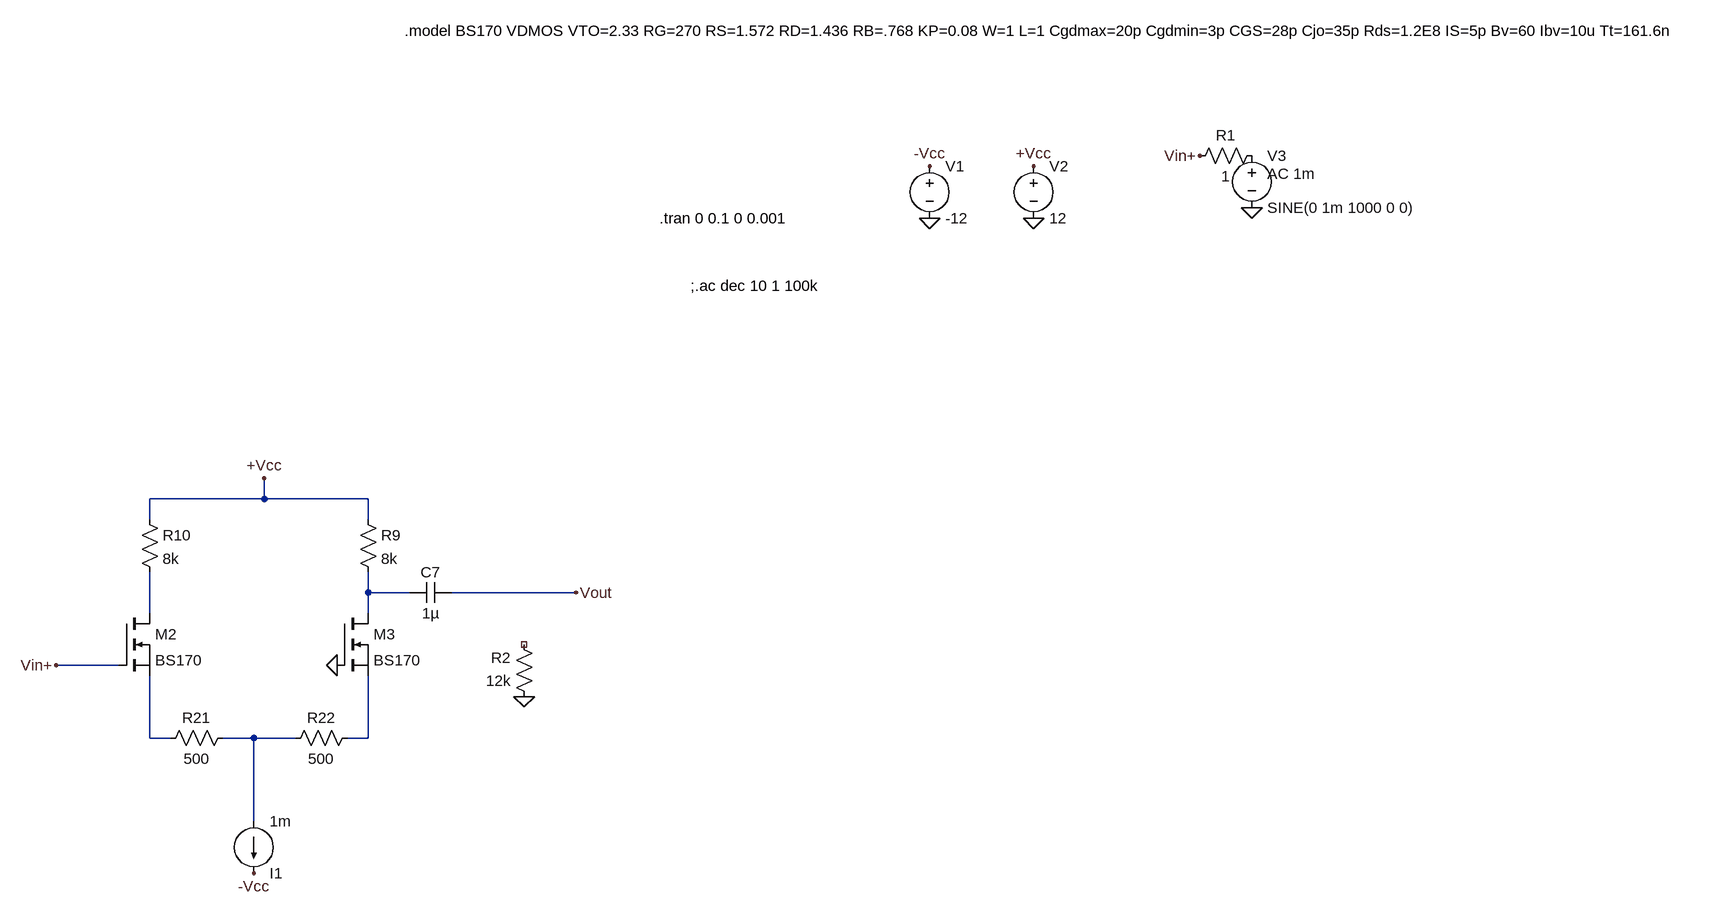
[diagram p0: schematic diff_amp.asc]
diff_amp.asc, the LTspice schematic file:
Version 4
SHEET 1 1780 864
WIRE -1936 192 -1936 160
WIRE -1936 192 -2112 192
WIRE -1776 192 -1936 192
WIRE -2112 224 -2112 192
WIRE -1776 224 -1776 192
WIRE -1776 336 -1776 304
WIRE -1712 336 -1776 336
WIRE -1456 336 -1648 336
WIRE -2112 368 -2112 304
WIRE -1776 368 -1776 336
WIRE -2160 448 -2256 448
WIRE -2112 560 -2112 464
WIRE -2080 560 -2112 560
WIRE -1952 560 -2000 560
WIRE -1888 560 -1952 560
WIRE -1776 560 -1776 464
WIRE -1776 560 -1808 560
WIRE -1952 688 -1952 560
FLAG -912 -240 0
FLAG -752 -240 0
FLAG -912 -320 -Vcc
FLAG -752 -320 +Vcc
FLAG -416 -256 0
FLAG -496 -336 Vin+
FLAG -1936 160 +Vcc
FLAG -2256 448 Vin+
FLAG -1824 448 0
FLAG -1952 768 -Vcc
FLAG -1456 336 Vout
FLAG -1536 496 0
SYMBOL voltage -912 -336 R0
WINDOW 123 0 0 Left 0
WINDOW 39 0 0 Left 0
SYMATTR InstName V1
SYMATTR Value -12
SYMBOL voltage -752 -336 R0
WINDOW 123 0 0 Left 0
WINDOW 39 0 0 Left 0
SYMATTR InstName V2
SYMATTR Value 12
SYMBOL voltage -416 -352 R0
WINDOW 123 24 44 Left 2
WINDOW 39 0 0 Left 0
SYMATTR Value2 AC 1m
SYMATTR InstName V3
SYMATTR Value SINE(0 1m 1000 0 0)
SYMBOL res -400 -352 R90
WINDOW 0 0 56 VBottom 2
WINDOW 3 32 56 VTop 2
SYMATTR InstName R1
SYMATTR Value 1
SYMBOL nmos -2160 368 R0
SYMATTR InstName M2
SYMATTR Value BS170
SYMBOL res -1792 208 R0
SYMATTR InstName R9
SYMATTR Value 8k
SYMBOL res -2128 208 R0
SYMATTR InstName R10
SYMATTR Value 8k
SYMBOL current -1952 688 R0
WINDOW 0 24 80 Left 2
WINDOW 3 24 0 Left 2
WINDOW 123 0 0 Left 0
WINDOW 39 0 0 Left 0
SYMATTR InstName I1
SYMATTR Value 1m
SYMBOL nmos -1824 368 R0
SYMATTR InstName M3
SYMATTR Value BS170
SYMBOL res -1984 544 R90
WINDOW 0 0 56 VBottom 2
WINDOW 3 32 56 VTop 2
SYMATTR InstName R21
SYMATTR Value 500
SYMBOL res -1792 544 R90
WINDOW 0 0 56 VBottom 2
WINDOW 3 32 56 VTop 2
SYMATTR InstName R22
SYMATTR Value 500
SYMBOL cap -1648 320 R90
WINDOW 0 0 32 VBottom 2
WINDOW 3 32 32 VTop 2
SYMATTR InstName C7
SYMATTR Value 1µ
SYMBOL res -1520 512 R180
WINDOW 0 36 76 Left 2
WINDOW 3 36 40 Left 2
SYMATTR InstName R2
SYMATTR Value 12k
TEXT -1328 -240 Left 2 !.tran 0 0.1 0 0.001
TEXT -1720 -528 Left 2 !.model BS170 VDMOS VTO=2.33 RG=270 RS=1.572 RD=1.436 RB=.768 KP=0.08 W=1 L=1 Cgdmax=20p Cgdmin=3p CGS=28p Cjo=35p Rds=1.2E8 IS=5p Bv=60 Ibv=10u Tt=161.6n
TEXT -1280 -136 Left 2 !;.ac dec 10 1 100k

The netlist it stands for:
* diff_amp.asc
V1 -Vcc 0 -12
V2 +Vcc 0 12
V3 P001 0 SINE(0 1m 1000 0 0) AC 1m
R1 P001 Vin+ 1
M2 N002 Vin+ N003 N003 BS170
R9 +Vcc N001 8k
R10 +Vcc N002 8k
I1 N004 -Vcc 1m
M3 N001 0 N005 N005 BS170
R21 N004 N003 500
R22 N005 N004 500
C7 Vout N001 1µ
R2 0 NC_01 12k
.model NMOS NMOS
.model PMOS PMOS
.lib standard.mos
.tran 0 0.1 0 0.001
.model BS170 VDMOS VTO=2.33 RG=270 RS=1.572 RD=1.436 RB=.768 KP=0.08 W=1 L=1 Cgdmax=20p Cgdmin=3p CGS=28p Cjo=35p Rds=1.2E8 IS=5p Bv=60 Ibv=10u Tt=161.6n
;.ac dec 10 1 100k
.backanno
.end